# Altium project stm32-can-converter-unit.PrjPcb (part 1 of 2)
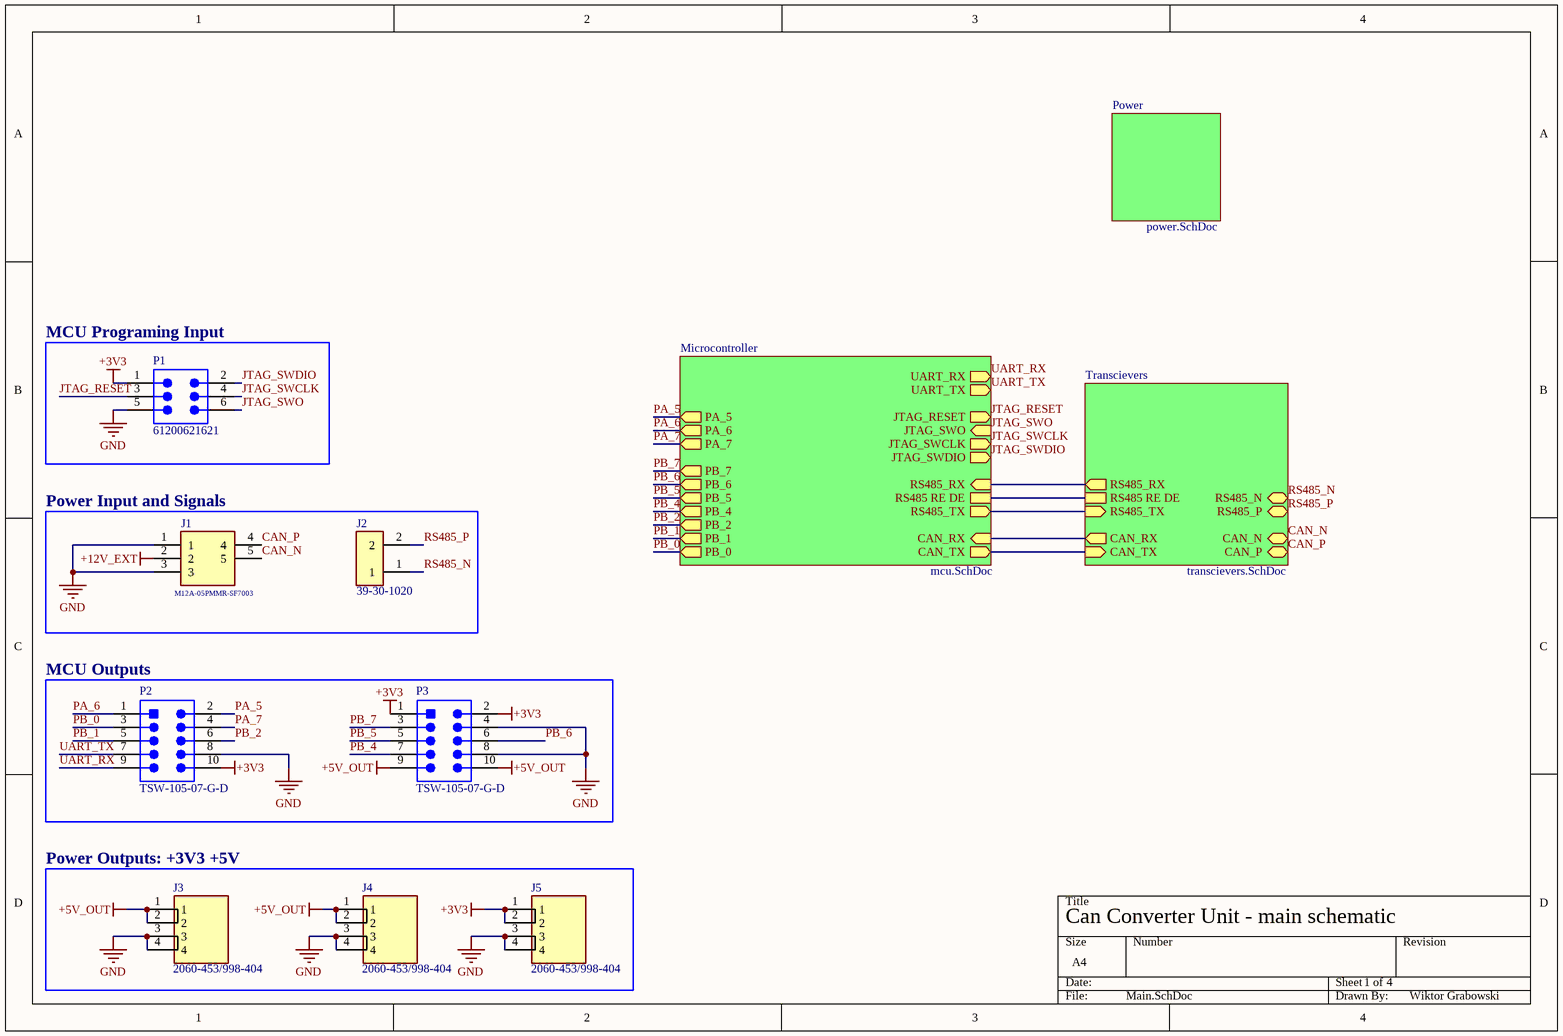
[diagram p0: Main.SchDoc]
4 sheets, 64 parts. Net scope: hierarchical (ports join the sheet entries above them; power ports are global).
Board file: CCU.PcbDoc
Sheets:
  Main.SchDoc
    Microcontroller = mcu.SchDoc
    Power = power.SchDoc
    Transcievers = transcievers.SchDoc

## Sheet Main.SchDoc
size A4; SheetNumber: 1; SheetTotal: 4

### Parts
J1  M12A-05PMMR-SF7003  [M12A05PMMRSF7003]
J2  39-30-1020  [39-30-1020]
J3  2060-453/998-404  [WAGO-2060-452-998-404]
J4  2060-453/998-404  [WAGO-2060-452-998-404]
J5  2060-453/998-404  [WAGO-2060-452-998-404]
P1  61200621621  [61200621621]
P2  TSW-105-07-G-D  [SMTC-TSW-105-07-G-D_V]
P3  TSW-105-07-G-D  [SMTC-TSW-105-07-G-D_V]

### Blocks framed on the sheet
MCU Programing Input: P1
Power Input and Signals: J1 J2
MCU Outputs: P2 P3
Power Outputs: +3V3 +5V: J3-J5

### Sub-sheets
Microcontroller = mcu.SchDoc: UART_TX (out), UART_RX (out), RS485_TX (out), RS485_RX (in), PA_5 (out), PB_1 (out), PB_2 (out), PB_7 (out), PB_6 (out), PB_5 (out), PB_4 (out), PB_0 (out), RS485 RE DE, JTAG_SWO (in), JTAG_SWCLK (out), JTAG_SWDIO (out), PA_7 (out), PA_6 (out), CAN_RX (in), CAN_TX (out), JTAG_RESET (out)
Power = power.SchDoc: no entries
Transcievers = transcievers.SchDoc: RS485_RX (out), RS485_TX (in), RS485 RE DE, CAN_P (bidir), CAN_N (bidir), RS485_N (bidir), RS485_P (bidir), CAN_RX (out), CAN_TX (in)

### Nets
+3V3: J5.1 J5.2 P1.1 P2.10 P3.1 P3.2
+5V_OUT: J3.1 J3.2 J4.1 J4.2 P3.9 P3.10
+12V_EXT: J1.2
GND: J1.1 J1.3 J3.3 J3.4 J4.3 J4.4 J5.3 J5.4 P1.5 P2.8 P3.4 P3.8
CAN RX: sheet Microcontroller/CAN_RX, sheet Transcievers/CAN_RX
CAN TX: sheet Microcontroller/CAN_TX, sheet Transcievers/CAN_TX
CAN_N: J1.5 ; sheet Transcievers/CAN_N
CAN_P: J1.4 ; sheet Transcievers/CAN_P
JTAG_RESET: P1.3 ; sheet Microcontroller/JTAG_RESET
JTAG_SWCLK: P1.4 ; sheet Microcontroller/JTAG_SWCLK
JTAG_SWDIO: P1.2 ; sheet Microcontroller/JTAG_SWDIO
JTAG_SWO: P1.6 ; sheet Microcontroller/JTAG_SWO
PA_5: P2.2 ; sheet Microcontroller/PA_5
PA_6: P2.1 ; sheet Microcontroller/PA_6
PA_7: P2.4 ; sheet Microcontroller/PA_7
PB_0: P2.3 ; sheet Microcontroller/PB_0
PB_1: P2.5 ; sheet Microcontroller/PB_1
PB_2: P2.6 ; sheet Microcontroller/PB_2
PB_4: P3.7 ; sheet Microcontroller/PB_4
PB_5: P3.5 ; sheet Microcontroller/PB_5
PB_6: P3.6 ; sheet Microcontroller/PB_6
PB_7: P3.3 ; sheet Microcontroller/PB_7
RS485 RX: sheet Microcontroller/RS485_RX, sheet Transcievers/RS485_RX
RS485 TX: sheet Microcontroller/RS485_TX, sheet Transcievers/RS485_TX
RS485_N: J2.1 ; sheet Transcievers/RS485_N
RS485_P: J2.2 ; sheet Transcievers/RS485_P
RS485_RE_DE: sheet Microcontroller/RS485 RE DE, sheet Transcievers/RS485 RE DE
UART_RX: P2.9 ; sheet Microcontroller/UART_RX
UART_TX: P2.7 ; sheet Microcontroller/UART_TX

### Notes on the sheet
- Can Converter Unit - main schematic
- 1
- 4
- Wiktor Grabowski

### Library data of the parts
J1 = M12A-05PMMR-SF7003: M12, A Code, 4A, 05 pins, Male Contact, Hexagonal, M12*1.0, PCB 90ø, Front Fastened, IP67; Manufacturer_Name: Amphenol; Manufacturer: Amphenol LTW; Geometry.Height: 15mm; Connector Type: Signal; Number of Positions: 5; Voltage Rating: 60V; Manufacturer_Part_Number: M12A-05PMMR-SF7003; Mouser Part Number: 523-M12A05PMMRSF7003; Mouser Price/Stock: https://www.mouser.co.uk/ProductDetail/Amphenol-LTW/M12A-05PMMR-SF7003?qs=f9yNj16SXrIdWSE1H9dLLQ%3D%3D; Arrow Part Number: M12A-05PMMR-SF7003; Arrow Price/Stock: https://www.arrow.com/en/products/m12a-05pmmr-sf7003/amphenol?utm_currency=USD&region=nac; Datasheet Link: https://amphenolltw.com/down.php?prod_files=605433; Supplier: Avnet; Supplier Part Number: 50AC2957; Manufacturer Part Number: M12A-05PMMR-SF7003; RoHS: Compliant; Category: Circular Connectors; Stock: 32; Current Rating: 4A; Gender: Male; Lifecycle Status: Production; Pins: 5; ComponentLink1URL: https://datasheet.octopart.com:443/M12A-05PMMR-SF7003-Amphenol-datasheet-182346588.pdf?src-supplier=IHS; ComponentLink1Description: https://datasheet.octopart.com:443/M12A-05PMMR-SF7003-Amphenol-datasheet-182346588.pdf?src-supplier=IHS; ComponentLink2URL: https://datasheet.octopart.com:443/M12A-05PMMR-SF7003-Amphenol-LTW-datasheet-184719079.pdf?src-supplier=TME; ComponentLink2Description: https://datasheet.octopart.com:443/M12A-05PMMR-SF7003-Amphenol-LTW-datasheet-184719079.pdf?src-supplier=TME; ComponentLink3URL: https://datasheet.octopart.com:443/M12A-05PMMR-SF7003-Amphenol-LTW-datasheet-180194516.pdf?src-supplier=JRH+Electronics; ComponentLink3Description: https://datasheet.octopart.com:443/M12A-05PMMR-SF7003-Amphenol-LTW-datasheet-180194516.pdf?src-supplier=JRH+Electronics
J2 = 39-30-1020: Pin Header, Power, 2 Rows, 2 Contacts, Through Hole Right Angle, Mini-Fit Jr. 5569; Manufacturer: Molex; Manufacturer Lifecycle Status: ACTIVE; Approvals: CSA, TUV, UL; Connector Type: Power, Rectangular; Contact Resistance: 10mΩ; Current Rating: 9A; Dielectric Material: Polyamide; Gender: Male; Glow Wire Compliant: Non-compliant; Insulation Resistance: 1GΩ; Number of Circuits: 2; Pitch: 4.2mm; Plating Thickness: 2.54µm; Voltage Rating: 600V; Supplier: RS; Supplier Part Number: 5109837P; Manufacturer Part Number: 39-30-1020; RoHS: Compliant; Category: Headers and Wire Housings; Stock: 13118; China RoHS: Compliant; Color: Natural; Contact Gender: Male; Contact Material: Brass; Contact Plating: Tin; Country of Origin: US; Depth: 13.38mm; ELV: Compliant; Flammability Rating: UL94 V-2; Halogen Free: Low Halogen; Height: 14.76mm; Housing Material: Nylon; Lead Free: Lead Free; Lead Pitch: 4.2mm; Length: 36.07mm; Lifecycle Status: Production; Material: Nylon; Max Operating Temperature: 105°C; Min Operating Temperature: -40°C; Mounting Technology: PCB, Through Hole; Number of Contacts: 2; Pins: 2; Number of Poles: 2; Number of Positions: 2; Number of Rows: 2; Orientation: Right Angle; Radiation Hardening: No; REACH SVHC: Yes; Row Spacing: 4.2mm; Schedule B: 8536694040, 8536694040|8536694040, 8536694040|8536694040|8536694040, 8536694040|8536694040|8536694040|8536694040; Termination: Solder; Voltage Rating (AC): 600V; Voltage Rating (DC): 600V; Working Voltage: 600V; ComponentLink1URL: https://datasheet.octopart.com:443/39-30-1020-Molex-datasheet-120074128.pdf?src-supplier=IHS; ComponentLink1Description: https://datasheet.octopart.com:443/39-30-1020-Molex-datasheet-120074128.pdf?src-supplier=IHS; ComponentLink2URL: https://datasheet.octopart.com:443/039301020-Molex-datasheet-8338717.pdf?src-supplier=Upverter; ComponentLink2Description: https://datasheet.octopart.com:443/039301020-Molex-datasheet-8338717.pdf?src-supplier=Upverter; ComponentLink3URL: https://datasheet.octopart.com:443/39-30-1020-Molex-datasheet-13785309.pdf?src-supplier=Molex; ComponentLink3Description: https://datasheet.octopart.com:443/39-30-1020-Molex-datasheet-13785309.pdf?src-supplier=Molex; ComponentLink4URL: https://sigma.octopart.com:443/15644801/technical_drawing/Molex-39-30-1020.pdf?src-supplier=Molex; ComponentLink4Description: https://sigma.octopart.com:443/15644801/technical_drawing/Molex-39-30-1020.pdf?src-supplier=Molex; ComponentLink5URL: https://datasheet.octopart.com:443/39-30-1020-Molex-datasheet-36854730.pdf?src-supplier=Farnell; ComponentLink5Description: https://datasheet.octopart.com:443/39-30-1020-Molex-datasheet-36854730.pdf?src-supplier=Farnell; ComponentLink6URL: https://datasheet.octopart.com:443/39-30-1020-Molex-datasheet-101582405.pdf?src-supplier=Farnell; ComponentLink6Description: https://datasheet.octopart.com:443/39-30-1020-Molex-datasheet-101582405.pdf?src-supplier=Farnell; ComponentLink7URL: https://datasheet.octopart.com:443/39-30-1020-..-Molex-datasheet-81470918.pdf?src-supplier=Farnell; ComponentLink7Description: https://datasheet.octopart.com:443/39-30-1020-..-Molex-datasheet-81470918.pdf?src-supplier=Farnell; ComponentLink8URL: https://datasheet.octopart.com:443/39-30-1020-Molex-datasheet-14711183.pdf?src-supplier=Farnell; ComponentLink8Description: https://datasheet.octopart.com:443/39-30-1020-Molex-datasheet-14711183.pdf?src-supplier=Farnell; ComponentLink9URL: https://datasheet.octopart.com:443/39-30-1020-Molex-datasheet-10541087.pdf?src-supplier=Farnell; ComponentLink9Description: https://datasheet.octopart.com:443/39-30-1020-Molex-datasheet-10541087.pdf?src-supplier=Farnell; ComponentLink10URL: https://datasheet.octopart.com:443/39301020-Molex-datasheet-514359.pdf?src-supplier=Farnell; ComponentLink10Description: https://datasheet.octopart.com:443/39301020-Molex-datasheet-514359.pdf?src-supplier=Farnell; ComponentLink11URL: https://datasheet.octopart.com:443/39-30-1020-Molex-datasheet-154749331.pdf?src-supplier=Master+Electronics; ComponentLink11Description: https://datasheet.octopart.com:443/39-30-1020-Molex-datasheet-154749331.pdf?src-supplier=Master+Electronics; ComponentLink12URL: https://datasheet.octopart.com:443/39-30-1020-Molex-datasheet-21827347.pdf?src-supplier=Electro+Sonic; ComponentLink12Description: https://datasheet.octopart.com:443/39-30-1020-Molex-datasheet-21827347.pdf?src-supplier=Electro+Sonic; ComponentLink13URL: https://datasheet.octopart.com:443/39-30-1020-Molex-datasheet-62104194.pdf?src-supplier=Electro+Sonic; ComponentLink13Description: https://datasheet.octopart.com:443/39-30-1020-Molex-datasheet-62104194.pdf?src-supplier=Electro+Sonic; ComponentLink14URL: https://datasheet.octopart.com:443/39-30-1020-Molex-datasheet-140183168.pdf?src-supplier=RS+(Formerly+Allied+Electronics); ComponentLink14Description: https://datasheet.octopart.com:443/39-30-1020-Molex-datasheet-140183168.pdf?src-supplier=RS+(Formerly+Allied+Electronics); ComponentLink15URL: https://datasheet.octopart.com:443/39-30-1020-Molex-datasheet-120148721.pdf?src-supplier=RS+(Formerly+Allied+Electronics); ComponentLink15Description: https://datasheet.octopart.com:443/39-30-1020-Molex-datasheet-120148721.pdf?src-supplier=RS+(Formerly+Allied+Electronics); ComponentLink16URL: https://datasheet.octopart.com:443/39-30-1020-Molex-datasheet-34442213.pdf?src-supplier=RS+(Formerly+Allied+Electronics); ComponentLink16Description: https://datasheet.octopart.com:443/39-30-1020-Molex-datasheet-34442213.pdf?src-supplier=RS+(Formerly+Allied+Electronics); ComponentLink17URL: https://datasheet.octopart.com:443/39-30-1020-Molex-datasheet-9997016.pdf?src-supplier=RS+(Formerly+Allied+Electronics); ComponentLink17Description: https://datasheet.octopart.com:443/39-30-1020-Molex-datasheet-9997016.pdf?src-supplier=RS+(Formerly+Allied+Electronics); ComponentLink18URL: https://datasheet.octopart.com:443/39-30-1020-Molex-datasheet-46140.pdf?src-supplier=RS+(Formerly+Allied+Electronics); ComponentLink18Description: https://datasheet.octopart.com:443/39-30-1020-Molex-datasheet-46140.pdf?src-supplier=RS+(Formerly+Allied+Electronics); ComponentLink19URL: https://datasheet.octopart.com:443/39301020-Molex-datasheet-82994803.pdf?src-supplier=Newark; ComponentLink19Description: https://datasheet.octopart.com:443/39301020-Molex-datasheet-82994803.pdf?src-supplier=Newark; ComponentLink20URL: https://datasheet.octopart.com:443/39-30-1020-Molex-datasheet-33002868.pdf?src-supplier=Newark; ComponentLink20Description: https://datasheet.octopart.com:443/39-30-1020-Molex-datasheet-33002868.pdf?src-supplier=Newark; ComponentLink21URL: https://datasheet.octopart.com:443/39-30-1020-Molex-datasheet-21207481.pdf?src-supplier=Newark; ComponentLink21Description: https://datasheet.octopart.com:443/39-30-1020-Molex-datasheet-21207481.pdf?src-supplier=Newark; ComponentLink22URL: https://datasheet.octopart.com:443/39-30-1020-Molex-datasheet-2405.pdf?src-supplier=Newark; ComponentLink22Description: https://datasheet.octopart.com:443/39-30-1020-Molex-datasheet-2405.pdf?src-supplier=Newark; ComponentLink23URL: https://datasheet.octopart.com:443/39301020-Molex-datasheet-137316104.pdf?src-supplier=Future+Electronics; ComponentLink23Description: https://datasheet.octopart.com:443/39301020-Molex-datasheet-137316104.pdf?src-supplier=Future+Electronics; ComponentLink24URL: https://datasheet.octopart.com:443/39-30-1020-Molex-datasheet-21395541.pdf?src-supplier=TME; ComponentLink24Description: https://datasheet.octopart.com:443/39-30-1020-Molex-datasheet-21395541.pdf?src-supplier=TME; ComponentLink25URL: https://datasheet.octopart.com:443/39301020-Molex-datasheet-7600579.pdf?src-supplier=Jameco; ComponentLink25Description: https://datasheet.octopart.com:443/39301020-Molex-datasheet-7600579.pdf?src-supplier=Jameco; ComponentLink26URL: https://datasheet.octopart.com:443/39-30-1020-Molex-datasheet-46912895.pdf?src-supplier=Jameco; ComponentLink26Description: https://datasheet.octopart.com:443/39-30-1020-Molex-datasheet-46912895.pdf?src-supplier=Jameco; ComponentLink27URL: https://datasheet.octopart.com:443/39-30-1020-Molex-datasheet-131607.pdf?src-supplier=DigiKey; ComponentLink27Description: https://datasheet.octopart.com:443/39-30-1020-Molex-datasheet-131607.pdf?src-supplier=DigiKey; ComponentLink28URL: http://sigma.octopart.com:80/15645372/rohs_certificate/Molex-39-30-1020.pdf?src-supplier=Compliance+Statements; ComponentLink28Description: http://sigma.octopart.com:80/15645372/rohs_certificate/Molex-39-30-1020.pdf?src-supplier=Compliance+Statements; ComponentLink29URL: http://sigma.octopart.com:80/conflict_mineral_statement/Molex-company-72.pdf?src-supplier=Compliance+Statements; ComponentLink29Description: http://sigma.octopart.com:80/conflict_mineral_statement/Molex-company-72.pdf?src-supplier=Compliance+Statements; ComponentLink30URL: http://sigma.octopart.com:80/rohs_statement/Molex-company-73.pdf?src-supplier=Compliance+Statements; ComponentLink30Description: http://sigma.octopart.com:80/rohs_statement/Molex-company-73.pdf?src-supplier=Compliance+Statements; ComponentLink31URL: http://sigma.octopart.com:80/reach_statement/Molex-company-74.pdf?src-supplier=Compliance+Statements; ComponentLink31Description: http://sigma.octopart.com:80/reach_statement/Molex-company-74.pdf?src-supplier=Compliance+Statements
J3-J5 = WAGO-2060-452-998-404: SMD Pcb Terminal Block, Push-button 0.75 MM² Pin Spacing 4 Mm 3-POLE White; Manufacturer: WAGO; Approvals: CSA, EN, IEC, KEMA, cUL; Current Rating: 9A; Number of Contacts: 3; Number of Levels: 1; Pitch: 4mm; Stripping Length: -7mm; Voltage Rating: 320V; Wire/Cable Gauge: 18AWG; Supplier: Arrow Electronics; Supplier Part Number: 2060-453/998-404; Manufacturer Part Number: 2060-453/998-404; RoHS: Compliant; Category: Terminal Blocks; Stock: 3276; Pricing: 1=0,602, 10=0,569, 25=0,552, 100=0,533, 500=0,528, 1000=0,523 (USD); China RoHS: Compliant; Color: White; Contact Material: Tin; Contact Plating: Tin; Flammability Rating: UL94 V-0; Height: 4.5mm; Lead Free: Lead Free; Length: 11.9mm; Lifecycle Status: Production; Material: Copper, Tin; Number of Rows: 1; Orientation: Horizontal; REACH SVHC: Yes; Schedule B: 8536695050; Width: 10.1mm; ComponentLink1URL: https://datasheet.octopart.com:443/2060-453-998-404-WAGO-datasheet-38222450.pdf?src-supplier=SOS+electronic; ComponentLink1Description: https://datasheet.octopart.com:443/2060-453-998-404-WAGO-datasheet-38222450.pdf?src-supplier=SOS+electronic; ComponentLink2URL: https://datasheet.octopart.com:443/2060-453-998-404-WAGO-datasheet-49279272.pdf?src-supplier=Newark; ComponentLink2Description: https://datasheet.octopart.com:443/2060-453-998-404-WAGO-datasheet-49279272.pdf?src-supplier=Newark; ComponentLink3URL: https://datasheet.octopart.com:443/2060-453-998-404-WAGO-datasheet-182466479.pdf?src-supplier=Future+Electronics; ComponentLink3Description: https://datasheet.octopart.com:443/2060-453-998-404-WAGO-datasheet-182466479.pdf?src-supplier=Future+Electronics; ComponentLink4URL: https://datasheet.octopart.com:443/2060-453-998-404-WAGO-datasheet-26529559.pdf?src-supplier=Future+Electronics; ComponentLink4Description: https://datasheet.octopart.com:443/2060-453-998-404-WAGO-datasheet-26529559.pdf?src-supplier=Future+Electronics; ComponentLink5URL: https://datasheet.octopart.com:443/2060-453-998-404-WAGO-datasheet-140898747.pdf?src-supplier=Future+Electronics; ComponentLink5Description: https://datasheet.octopart.com:443/2060-453-998-404-WAGO-datasheet-140898747.pdf?src-supplier=Future+Electronics; ComponentLink6URL: https://datasheet.octopart.com:443/2060-453-998-404-WAGO-datasheet-164886439.pdf?src-supplier=Burklin+Elektronik; ComponentLink6Description: https://datasheet.octopart.com:443/2060-453-998-404-WAGO-datasheet-164886439.pdf?src-supplier=Burklin+Elektronik
P1 = CMP-1502-00000-2: NexarPartId: 32855456; Number of Positions: 6; Gender: Male; Pitch: 2.54mm; Connector Type: Male Pin; Insulation Resistance: 1GΩ; Contact Resistance: 20mΩ; Operating Supply Voltage: 250V; Current Rating: 3A; Termination: Solder; RoHS: Compliant; Length: 15.28mm; Contact Material: Copper; Number of Pins: 6; Min Operating Temperature: -40°C; Number of Contacts: 6; Number of Rows: 2; Contact Plating: Gold; Color: Black; Mount: Through Hole; Lead Pitch: 2.54mm; Insulation Material: PBT; REACH SVHC: Unknown; Row Spacing: 2.54mm; Orientation: Vertical; Max Operating Temperature: 105°C
P2 P3 = CMP-2000-07330-1: Post Terminal Strip Assembly, Pitch 2.54 mm, 2 x 5 Position, Height 8.58 mm, Tail Length 2.54 mm, -55 to 125 degC, RoHS, Bulk; Manufacturer: Samtec-Inc.; Connector Type: Header,Unshrouded; Number of Positions Loaded: All; Pitch: 0.100"(2.54mm); Number of Positions: 10; Package Reference: TSW-105-07-G-D; Mounting Technology: ThroughHole; Datasheet URL: http://suddendocs.samtec.com/prints/tsw-xxx-xx-xxx-x-xx-xxx-mkt.pdf; Termination: Solder; Packaging: Bulk; Number of Rows: 2; Contact Finish: Gold; Mounting Type: ThroughHole; Features: -; Color: Black; Category: Connectors,Interconnects; Family: RectangularConnectors-Headers,MalePins; Manufacturer URL: http://www.samtec.com/; Series: TSW; Fastening Type: -; Package URL: http://suddendocs.samtec.com/prints/tsw-xxx-xx-x-x-xx-xxx-footprint.pdf; Row Spacing: 0.100"(2.54mm); Contact Mating Length: 0.230"(5.84mm); Contact Finish Thickness: 10µin(0.25µm); Contact Type: MalePin; Package Description: Male Header, Pitch 2.54 mm, 2 x 5 Position, Height 8.58 mm, Tail Length 2.54 mm; Datasheet Version: Rev. DO, 08/1988

## Sheet mcu.SchDoc
size A4; SheetNumber: 3; SheetTotal: 4
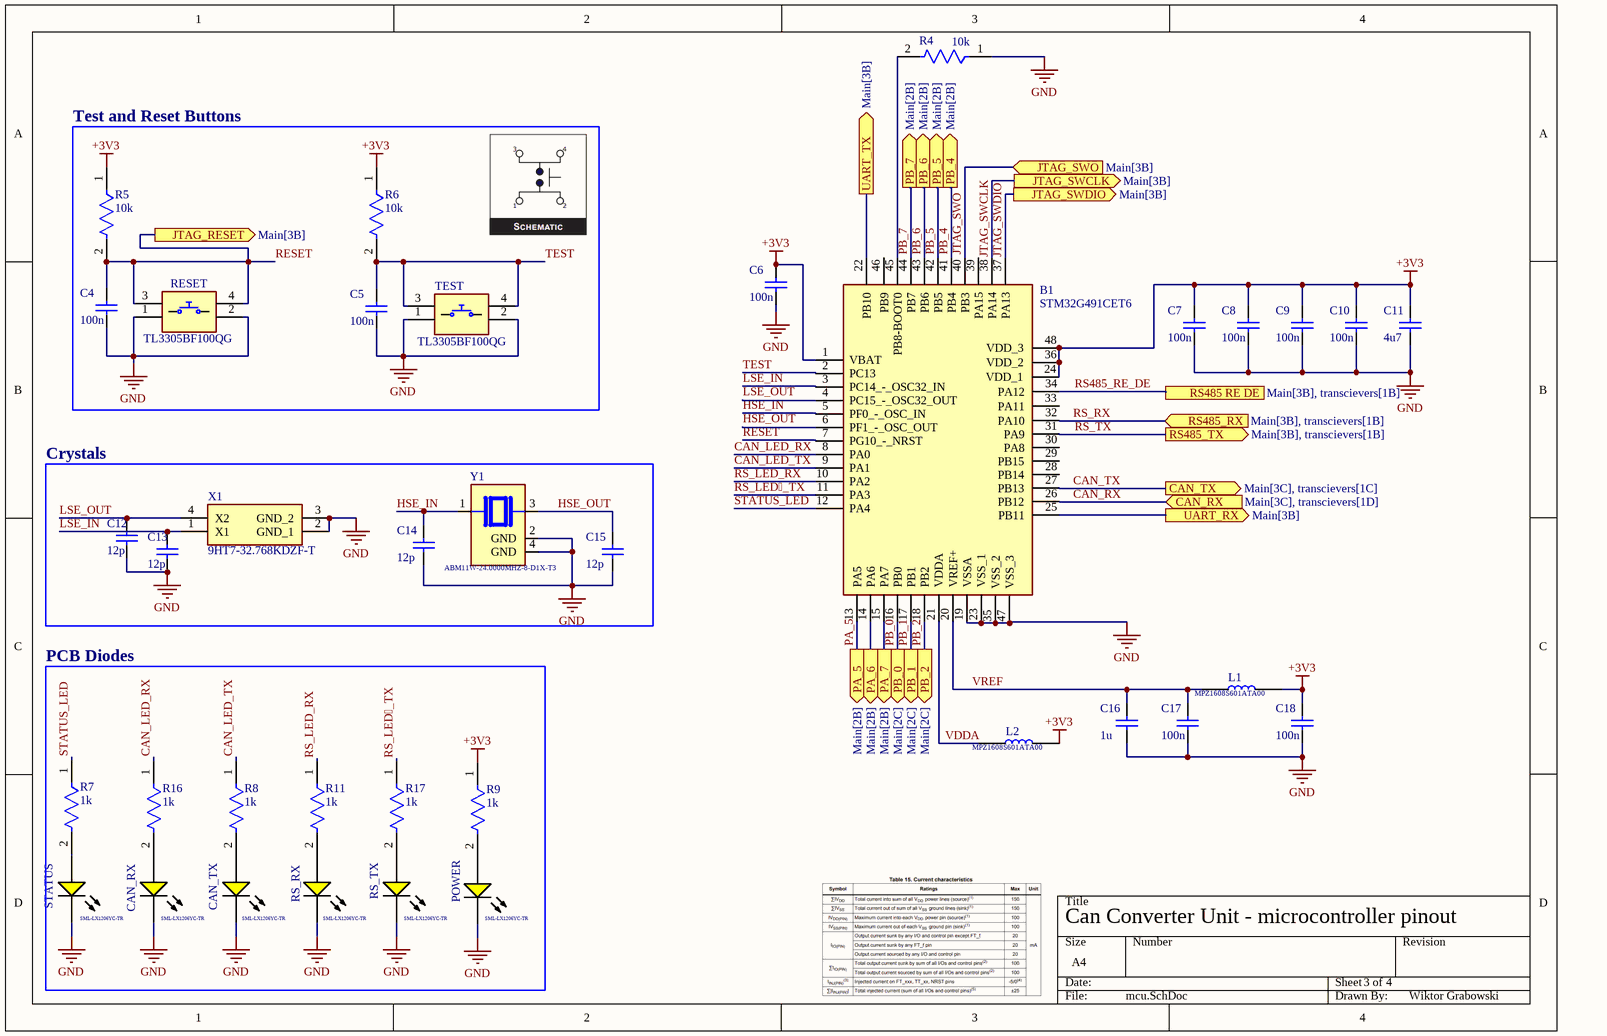
[diagram p1: mcu.SchDoc]

### Parts
B1  STM32G491CET6  [STM32G491CET6]
C4  100n  [CAPC1206(3216)170_M]
C5  100n  [CAPC1206(3216)170_M]
C6  100n  [CAPC1206(3216)170_M]
C7  100n  [CAPC1206(3216)170_M]
C8  100n  [CAPC1206(3216)170_M]
C9  100n  [CAPC1206(3216)170_M]
C10  100n  [CAPC1206(3216)170_M]
C11  4u7  [CAPC1206(3216)170_M]
C12  12p  [CAPC1206(3216)170_M]
C13  12p  [CAPC1206(3216)170_M]
C14  12p  [CAPC1206(3216)170_M]
C15  12p  [CAPC1206(3216)170_M]
C16  1u  [CAPC1206(3216)170_M]
C17  100n  [CAPC1206(3216)170_M]
C18  100n  [CAPC1206(3216)170_M]
CAN_RX  SML-LX1206YC-TR  [LUMX-SML-LX1206YC-TR_V]
CAN_TX  SML-LX1206YC-TR  [LUMX-SML-LX1206YC-TR_V]
L1  MPZ1608S601ATA00  [INDC1608X95N]
L2  MPZ1608S601ATA00  [INDC1608X95N]
POWER  SML-LX1206YC-TR  [LUMX-SML-LX1206YC-TR_V]
R4  10k  [FP-RK73H2B-MFG]
R5  10k  [FP-RK73H2B-MFG]
R6  10k  [FP-RK73H2B-MFG]
R7  1k  [FP-RK73H2B-MFG]
R8  1k  [FP-RK73H2B-MFG]
R9  1k  [FP-RK73H2B-MFG]
R11  1k  [FP-RK73H2B-MFG]
R16  1k  [FP-RK73H2B-MFG]
R17  1k  [FP-RK73H2B-MFG]
RESET  TL3305BF100QG  [TL3305BF160QG]
RS_RX  SML-LX1206YC-TR  [LUMX-SML-LX1206YC-TR_V]
RS_TX  SML-LX1206YC-TR  [LUMX-SML-LX1206YC-TR_V]
STATUS  SML-LX1206YC-TR  [LUMX-SML-LX1206YC-TR_V]
TEST  TL3305BF100QG  [TL3305BF160QG]
X1  9HT7-32.768KDZF-T  [9HT732768KDZFT]
Y1  ABM11W-24.0000MHZ-8-D1X-T3  [XTAL_ABM11W-24.0000MHZ-8-D1X-T3]

### Blocks framed on the sheet
Test and Reset Buttons: C4 C5 R5 R6 RESET TEST
Crystals: C12-C15 X1 Y1
PCB Diodes: CAN_RX CAN_TX POWER R7-R9 R11 R16 R17 RS_RX RS_TX STATUS

### Ports
CAN_RX (in, see Main[3C], transcievers[1D]), CAN_TX (out, see Main[3C], transcievers[1C]), JTAG_RESET (out, see Main[3B]), JTAG_SWCLK (out, see Main[3B]), JTAG_SWDIO (out, see Main[3B]), JTAG_SWO (in, see Main[3B]), PA_5 (out, see Main[2B]), PA_6 (out, see Main[2B]), PA_7 (out, see Main[2B]), PB_0 (out, see Main[2C]), PB_1 (out, see Main[2C]), PB_2 (out, see Main[2C]), PB_4 (out, see Main[2B]), PB_5 (out, see Main[2B]), PB_6 (out, see Main[2B]), PB_7 (out, see Main[2B]), RS485 RE DE (see Main[3B], transcievers[1B]), RS485_RX (in, see Main[3B], transcievers[1B]), RS485_TX (out, see Main[3B], transcievers[1B]), UART_RX (out, see Main[3B]), UART_TX (out, see Main[3B])

### Nets
+3V3: B1.1(VBAT) B1.24(VDD_1) B1.36(VDD_2) B1.48(VDD_3) C6.2 C7.2 C8.2 C9.2 C10.2 C11.2 C18.2 L1.2 L2.2 R5.1 R6.1 R9.1
GND: B1.19(VSSA) B1.23(VSS_1) B1.35(VSS_2) B1.47(VSS_3) C4.1 C5.1 C6.1 C7.1 C8.1 C9.1 C10.1 C11.1 C12.1 C13.1 C14.1 C15.1 C16.1 C17.1 C18.1 CAN_RX.2(K) CAN_TX.2(K) POWER.2(K) R4.1 RESET.1 RESET.2 RS_RX.2(K) RS_TX.2(K) STATUS.2(K) TEST.1 TEST.2 X1.2(GND_1) X1.3(GND_2) Y1.2(GND) Y1.4(GND)
CAN_LED_RX: B1.8(PA0) R16.1
CAN_LED_TX: B1.9(PA1) R8.1
CAN_RX: B1.26(PB12) ; port CAN_RX  [project net CAN RX]
CAN_TX: B1.27(PB13) ; port CAN_TX  [project net CAN TX]
HSE_IN: B1.5(PF0_-_OSC_IN) C14.2 Y1.1
HSE_OUT: B1.6(PF1_-_OSC_OUT) C15.2 Y1.3
JTAG_SWCLK: B1.38(PA14) ; port JTAG_SWCLK
JTAG_SWDIO: B1.37(PA13) ; port JTAG_SWDIO
JTAG_SWO: B1.40(PB3) ; port JTAG_SWO
LSE_IN: B1.3(PC14_-_OSC32_IN) C13.2 X1.1(X1)
LSE_OUT: B1.4(PC15_-_OSC32_OUT) C12.2 X1.4(X2)
PA_5: B1.13(PA5) ; port PA_5
PA_6: B1.14(PA6) ; port PA_6
PA_7: B1.15(PA7) ; port PA_7
PB_0: B1.16(PB0) ; port PB_0
PB_1: B1.17(PB1) ; port PB_1
PB_2: B1.18(PB2) ; port PB_2
PB_4: B1.41(PB4) ; port PB_4
PB_5: B1.42(PB5) ; port PB_5
PB_6: B1.43(PB6) ; port PB_6
PB_7: B1.44(PB7) ; port PB_7
RESET: B1.7(PG10_-_NRST) C4.2 R5.2 RESET.3 RESET.4 ; port JTAG_RESET  [project net JTAG_RESET]
RS485_RE_DE: B1.34(PA12) ; port RS485 RE DE
RS_LED_TX: B1.11(PA3) R17.1
RS_LED_RX: B1.10(PA2) R11.1
RS_RX: B1.32(PA10) ; port RS485_RX  [project net RS485 RX]
RS_TX: B1.31(PA9) ; port RS485_TX  [project net RS485 TX]
STATUS_LED: B1.12(PA4) R7.1
TEST: B1.2(PC13) C5.2 R6.2 TEST.3 TEST.4
UART_RX: B1.25(PB11) ; port UART_RX
UART_TX: B1.22(PB10) ; port UART_TX
VDDA: B1.21(VDDA) L2.1
VREF: B1.20(VREF+) C16.2 C17.2 L1.1
NetB1_45: B1.45(PB8-BOOT0) R4.2
NetCAN_RX_1: CAN_RX.1(A) R16.2
NetCAN_TX_1: CAN_TX.1(A) R8.2
NetPOWER_1: POWER.1(A) R9.2
NetR7_2: R7.2 STATUS.1(A)
NetR11_2: R11.2 RS_RX.1(A)
NetR17_2: R17.2 RS_TX.1(A)

Not connected (* = marked no-connect by the designer): B1 28(PB14) 29(PB15) 30(PA8) 33(PA11) 39(PA15) 46(PB9)

### Notes on the sheet
- Can Converter Unit - microcontroller pinout
- 3
- 4
- Wiktor Grabowski

### Library data of the parts
B1 = STM32G491CET6: ARM Microcontrollers - MCU Mainstream Arm Cortex-M4+ MCU 170MHz with 512Kbytes of Flash memory; Manufacturer_Name: STMicroelectronics; Geometry.Height: 1.6mm; Manufacturer_Part_Number: STM32G491CET6; Mouser Part Number: 511-STM32G491CET6; Mouser Price/Stock: https://www.mouser.co.uk/ProductDetail/STMicroelectronics/STM32G491CET6?qs=eP2BKZSCXI5LxAF%2FNuF5Tg%3D%3D; Arrow Part Number: STM32G491CET6; Arrow Price/Stock: https://www.arrow.com/en/products/stm32g491cet6/stmicroelectronics?region=nac; Datasheet Link: https://cz.mouser.com/datasheet/2/389/dm00654712-2042072.pdf; Supplier: Mouser; Supplier Part Number: 511-STM32G491CET6; Supplier 1: Mouser; Supplier Part Number 1: 511-STM32G491CET6; ComponentLink1Description: Datasheet; ComponentLink1URL: https://datasheet.octopart.com/STM32G491CET6-STMicroelectronics-datasheet-151949616.pdf?src-supplier=Future+Electronics
C4-C18 = CMP-1037-04008-1: CAP 47nF 200V ±10% 1206 (3216 Metric) Thickness 1.7mm SMD; Tolerance: Â±10%; Case-EIA: 1206; Case-Metric: 3216; Technology: SMT; Max Thickness: 1.7 mm; Value: 47nF; Rated Voltage: 200 V
CAN_RX CAN_TX POWER RS_RX RS_TX STATUS = CMP-2000-07124-1: Yellow LED, Water Clear Len, 585 nm, 2.1 V, -40 to 85 degC, 2-Pin SMD, RoHS, Tape and Reel; Manufacturer: Lumex; Product Training Modules: LEDsBenefitsofCustomLEDandLCDTechnology; Millicandela Rating: 6mcd; Catalog Drawings: SML-LX1206SeriesTopSML-LX1206SeriesSideSML-LX1206SeriesBottomSML-LX1206SeriesFootprint; Wavelength - Peak: 585nm; Other Names: 67-1358-2LU60357TRSMLLX1206YCTR; Lens Style/Size: RectanglewithFlatTop; Current - Test: 20mA; Lens Color: Colorless; Viewing Angle: 160°; Voltage - Forward (Vf) (Typ): 2.1V; Online Catalog: SML-LX1206RectanglewithFlatTop1206PackageLEDs; Mounting Type: SurfaceMount; Package Description: 2-Pin Surface Mount Device, Body 3.2 x 1.5 mm; Datasheet Version: Rev. K, 08/2012; Features: -; Color: Yellow; RoHS Information: RoHSCertofCompliance; Package Reference: SML-LX1206YC-TR; Supplier Device Package: 1206; Standard Package: 3,000; Series: -; Wavelength - Dominant: -; Package / Case: 1206(3216Metric); Mounting Technology: SurfaceMount; Height (Max): 1.10mm; Lens Transparency: Clear; Datasheet URL: http://www.lumex.com/content/files/ProductAttachment/SML-LX1206YC-TR.pdf; Family: LEDIndication-Discrete; Manufacturer URL: http://www.lumexinstruments.com/; Packaging: Tape&Reel(TR); Category: Optoelectronics; Size / Dimension: 3.20mmLx1.60mmW
L1 L2 = MPZ1608S601ATA00: Ferrite Beads Multi-Layer 600Ohm 25% 100MHz 1A 0.15Ohm DCR 0603 T/R; Manufacturer Lifecycle Status: PRODUCTION; MF: TDK; DC Resistance (DCR): 150mΩ; Impedance: 600Ω; Number of Circuits: 1; SnapEDA_Link: https://www.snapeda.com/parts/MPZ1608S601ATA00/TDK/view-part/?ref=snap; Package: 0603 TDK; Value: *; MP: MPZ1608S601ATA00; Check_prices: https://www.snapeda.com/parts/MPZ1608S601ATA00/TDK/view-part/?ref=eda; Supplier: Farnell; Supplier Part Number: 2800777; Manufacturer: TDK; Manufacturer Part Number: MPZ1608S601ATA00; RoHS: Compliant; Category: Ferrite Beads and Chips; Stock: 80000; Case/Package: 0603; Case Code (Imperial): 0603; Case Code (Metric): 1608; China RoHS: Compliant; Core Material: Ferrite; Current Rating: 1A; Depth: 800µm; Height: 800µm; Lead Free: Lead Free; Length: 1.6mm; Lifecycle Status: Production; Max DC Current: 1A; Clock Frequency: 100MHz; Max Length: 1.75mm; Max Operating Temperature: 125°C; Max Width: 950µm; Min Length: 1.45mm; Min Operating Temperature: -55°C; Min Width: 650µm; Mounting Technology: Surface Mount; Number of Terminals: 2; Packaging: Cut Tape; REACH SVHC: Yes; RMS Current (Irms): 1A; Schedule B: 8504500000, 8504500000|8504500000|8504500000|8504500000|8504500000; ESR: 150mΩ; Termination: SMD/SMT; Test Frequency: 100MHz; Tolerance: 25%; Weight: 2.012816mg; Width: 800µm; ComponentLink1URL: https://datasheet.octopart.com:443/MPZ1608S601ATA00-TDK-datasheet-155380319.pdf?src-supplier=TDK; ComponentLink1Description: https://datasheet.octopart.com:443/MPZ1608S601ATA00-TDK-datasheet-155380319.pdf?src-supplier=TDK; ComponentLink2URL: https://datasheet.octopart.com:443/MPZ1608S601ATA00-TDK-datasheet-141913842.pdf?src-supplier=TME; ComponentLink2Description: https://datasheet.octopart.com:443/MPZ1608S601ATA00-TDK-datasheet-141913842.pdf?src-supplier=TME; ComponentLink3URL: https://datasheet.octopart.com:443/MPZ1608S601ATA00-TDK-datasheet-82475260.pdf?src-supplier=Newark; ComponentLink3Description: https://datasheet.octopart.com:443/MPZ1608S601ATA00-TDK-datasheet-82475260.pdf?src-supplier=Newark; ComponentLink4URL: https://datasheet.octopart.com:443/MPZ1608S601ATA00-TDK-datasheet-99917310.pdf?src-supplier=Newark; ComponentLink4Description: https://datasheet.octopart.com:443/MPZ1608S601ATA00-TDK-datasheet-99917310.pdf?src-supplier=Newark; ComponentLink5URL: https://datasheet.octopart.com:443/MPZ1608S601ATA00-TDK-datasheet-8852356.pdf?src-supplier=Newark; ComponentLink5Description: https://datasheet.octopart.com:443/MPZ1608S601ATA00-TDK-datasheet-8852356.pdf?src-supplier=Newark; ComponentLink6URL: https://datasheet.octopart.com:443/MPZ1608S601ATA00-TDK-datasheet-21631858.pdf?src-supplier=Farnell; ComponentLink6Description: https://datasheet.octopart.com:443/MPZ1608S601ATA00-TDK-datasheet-21631858.pdf?src-supplier=Farnell; ComponentLink7URL: https://datasheet.octopart.com:443/MPZ1608S601ATA00-TDK-datasheet-38423207.pdf?src-supplier=Future+Electronics; ComponentLink7Description: https://datasheet.octopart.com:443/MPZ1608S601ATA00-TDK-datasheet-38423207.pdf?src-supplier=Future+Electronics
R4-R9 R11 R16 R17 = CMP-04015-098385-1: 40.2kΩ ±1% 0.25W Chip Resistor 1206 Thick Film AEC-Q200 Qualified; Resistance: 40.2kR; Voltage Rating (DC): 200V; Temperature Coefficient: 100ppm/°C; Power Rating: 250mW; Tolerance: 1%; Package Quantity: 5000; Length: 3.2mm; Termination: SMD/SMT; Lead Free: Contains Lead; Case Code (Imperial): 1206; Case/Package: 1206; Voltage Rating: 200V; Case Code (Metric): 3216; Max Operating Temperature: 155°C; Packaging: Tape and Reel; Width: 1.6mm; Series: RK73H; Min Operating Temperature: -55°C; RoHS Compliant: No; Height: 0.6mm
RESET TEST = TL3305BF100QG: TL3305 Ultra-Miniature Tact Switch 100gf 5.0mm actuator Silver Contact Gullwing; Manufacturer_Name: E-Switch; Datasheet Link: https://configured-product-images.s3.amazonaws.com/2D/specs/TL3305BF100QG.pdf; Manufacturer_Part_Number: TL3305BF100QG; Mouser Part Number: 612-TL3305BF100QG; Mouser Price/Stock: https://www.mouser.co.uk/ProductDetail/E-Switch/TL3305BF100QG?qs=IKkN%2F947nfDIPwqPQja%252BvQ%3D%3D; Supplier: Farnell; Supplier Part Number: 4539028; Manufacturer: E-Switch; Manufacturer Part Number: TL3305BF100QG; RoHS: Compliant; Category: Tactile Switches; Stock: 11760; ComponentLink1URL: https://datasheet.octopart.com:443/TL3305BF100QG-E-Switch-datasheet-181388209.pdf?src-supplier=Future+Electronics; ComponentLink1Description: https://datasheet.octopart.com:443/TL3305BF100QG-E-Switch-datasheet-181388209.pdf?src-supplier=Future+Electronics; ComponentLink2URL: https://datasheet.octopart.com:443/TL3305BF100QG-E-Switch-datasheet-188129426.pdf?src-supplier=Future+Electronics; ComponentLink2Description: https://datasheet.octopart.com:443/TL3305BF100QG-E-Switch-datasheet-188129426.pdf?src-supplier=Future+Electronics
X1 = 9HT7-32.768KDZF-T: Parallel - Fundamental Quartz Crystal, 0.032768MHz Nom; Manufacturer_Name: TXC CORPORATION; Manufacturer: TXC; Geometry.Height: 1.4mm; ESR (Equivalent Series Resistance): 65kΩ; Frequency: 32.768kHz; Frequency Tolerance: 0.002%; Load Capacitance: 12.5pF; Manufacturer_Part_Number: 9HT7-32.768KDZF-T; Mouser Part Number: 717-9HT7-32.768KDZFT; Mouser Price/Stock: https://www.mouser.co.uk/ProductDetail/TXC-Corporation/9HT7-32.768KDZF-T?qs=MEJ8UTjcHDlobjP3Uu4Bsg%3D%3D; Arrow Part Number: 9HT7-32.768KDZF-T; Arrow Price/Stock: https://www.arrow.com/en/products/9ht7-32.768kdzf-t/txc-corporation?region=nac; Datasheet Link: https://componentsearchengine.com/Datasheets/2/9HT7-32.768KDZF-T.pdf; Supplier: Farnell; Supplier Part Number: 2819319; Manufacturer Part Number: 9HT7-32.768KDZF-T; RoHS: Compliant; Category: Crystals; Stock: 7957; Case/Package: SMD/SMT; Height: 508µm; Lead Free: Lead Free; Length: 1.4mm; Lifecycle Status: Production; Max Operating Temperature: 85°C; Min Operating Temperature: -40°C; Mounting Technology: Surface Mount; Packaging: Tape & Reel; REACH SVHC: No; Schedule B: 8541600080, 8541600080|8541600080|8541600080|8541600080|8541600080|8541600080|8541600080|8541600080|8541600080|8541600080|8541600080|8541600080|8541600080|8541600080|8541600080|8541600080|8541600080|8541600080|8541600080|8541600080|8541600080|8541600080|8541600080|85; Termination: SMD/SMT; Tolerance: 0.002%; Width: 1.397mm; ComponentLink1URL: https://datasheet.octopart.com:443/9HT7-32.768KDZF-T-TXC-datasheet-21225340.pdf?src-supplier=element14+APAC; ComponentLink1Description: https://datasheet.octopart.com:443/9HT7-32.768KDZF-T-TXC-datasheet-21225340.pdf?src-supplier=element14+APAC; ComponentLink2URL: https://datasheet.octopart.com:443/9HT7-32.768KDZF-T-TXC-datasheet-181441158.pdf?src-supplier=Newark; ComponentLink2Description: https://datasheet.octopart.com:443/9HT7-32.768KDZF-T-TXC-datasheet-181441158.pdf?src-supplier=Newark; ComponentLink3URL: https://datasheet.octopart.com:443/9HT7-32.768KDZF-T-TXC-datasheet-188932442.pdf?src-supplier=TME; ComponentLink3Description: https://datasheet.octopart.com:443/9HT7-32.768KDZF-T-TXC-datasheet-188932442.pdf?src-supplier=TME
Y1 = ABM11W-24.0000MHZ-8-D1X-T3: Crystal, Quartz, 24 MHz, SMD, 2mm x 1.6mm x 0.5mm, 20 ppm, 8 pF, 10 ppm, ABM11W; Manufacturer: Abracon; MF: Abracon LLC; ESR (Equivalent Series Resistance): 100Ω; Frequency: 24MHz; Frequency Stability: 20ppm; Frequency Tolerance: 0.001%; Load Capacitance: 8pF; ESR: 30Ω; SnapEDA_Link: https://www.snapeda.com/parts/ABM11W-24.0000MHZ-8-D1X-T3/Abracon/view-part/?ref=snap; Package: SMD-4 Abracon LLC; Value: *; MP: ABM11W-24.0000MHZ-8-D1X-T3; Check_prices: https://www.snapeda.com/parts/ABM11W-24.0000MHZ-8-D1X-T3/Abracon/view-part/?ref=eda; Supplier: DigiKey; Supplier Part Number: 535-13835-1-ND; Manufacturer Part Number: ABM11W-24.0000MHZ-8-D1X-T3; RoHS: Compliant; Category: Crystals; Stock: 2752; Pricing: 1=0,38, 10=0,334, 25=0,3156, 50=0,3024, 100=0,29, 250=0,27424, 500=0,26288, 1000=0,25201 (USD); China RoHS: Compliant; Height: 500µm; Length: 2mm; Lifecycle Status: Production; Max Operating Temperature: 85°C; Min Operating Temperature: -40°C; Mounting Technology: Surface Mount; REACH SVHC: Yes; Tolerance: 0.001%; Width: 1.6mm; ComponentLink1URL: https://datasheet.octopart.com:443/ABM11W-24.0000MHZ-8-D1X-T3-Abracon-datasheet-154833168.pdf?src-supplier=IHS; ComponentLink1Description: https://datasheet.octopart.com:443/ABM11W-24.0000MHZ-8-D1X-T3-Abracon-datasheet-154833168.pdf?src-supplier=IHS; ComponentLink2URL: https://datasheet.octopart.com:443/ABM11W-24.0000MHZ-8-D1X-T3-Abracon-datasheet-102760955.pdf?src-supplier=Upverter; ComponentLink2Description: https://datasheet.octopart.com:443/ABM11W-24.0000MHZ-8-D1X-T3-Abracon-datasheet-102760955.pdf?src-supplier=Upverter; ComponentLink3URL: https://datasheet.octopart.com:443/ABM11W-24.0000MHZ-8-D1X-T3-Abracon-datasheet-112015802.pdf?src-supplier=Master+Electronics; ComponentLink3Description: https://datasheet.octopart.com:443/ABM11W-24.0000MHZ-8-D1X-T3-Abracon-datasheet-112015802.pdf?src-supplier=Master+Electronics; ComponentLink4URL: https://datasheet.octopart.com:443/ABM11W-24.0000MHZ-8-D1X-T3-Abracon-datasheet-182204996.pdf?src-supplier=Master+Electronics; ComponentLink4Description: https://datasheet.octopart.com:443/ABM11W-24.0000MHZ-8-D1X-T3-Abracon-datasheet-182204996.pdf?src-supplier=Master+Electronics; ComponentLink5URL: https://sigma.octopart.com:443/141159858/technical_drawing/Abracon-ABM11W-24.0000MHZ-8-D1X-T3.pdf?src-supplier=Abracon+SCT; ComponentLink5Description: https://sigma.octopart.com:443/141159858/technical_drawing/Abracon-ABM11W-24.0000MHZ-8-D1X-T3.pdf?src-supplier=Abracon+SCT; ComponentLink6URL: http://sigma.octopart.com:80/conflict_mineral_statement/Abracon-company-27.pdf?src-supplier=Compliance+Statements; ComponentLink6Description: http://sigma.octopart.com:80/conflict_mineral_statement/Abracon-company-27.pdf?src-supplier=Compliance+Statements

## Sheet power.SchDoc
size A4; SheetNumber: 4; SheetTotal: 4
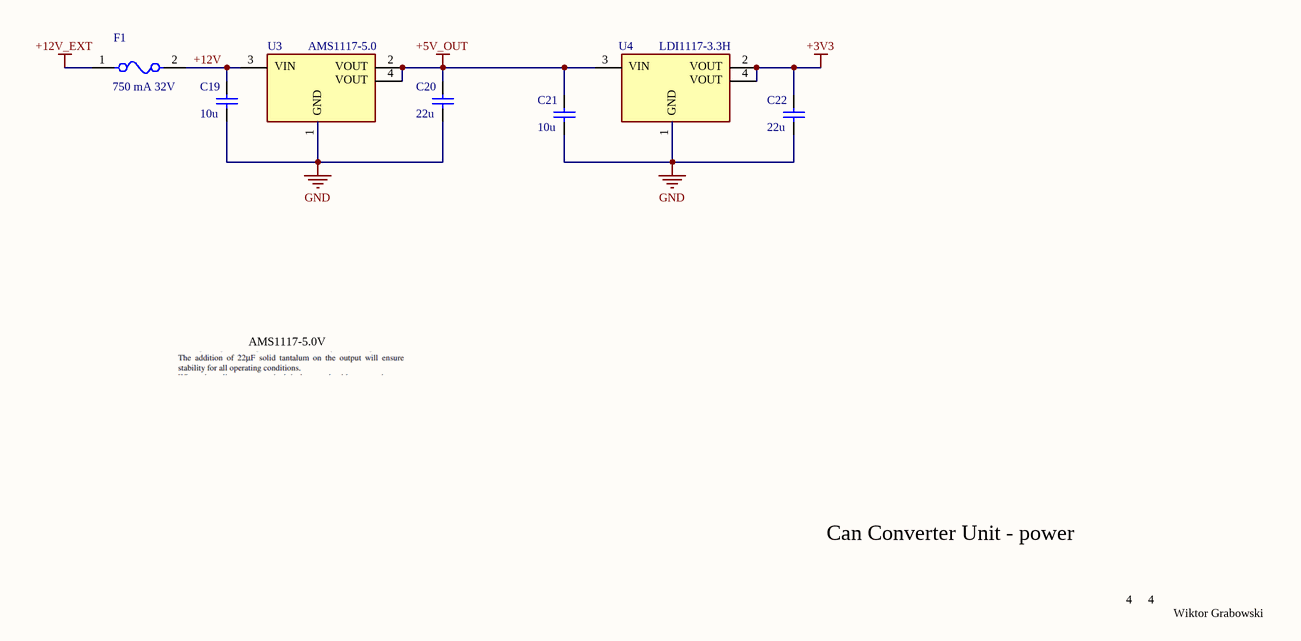
[diagram p2: power.SchDoc]

### Parts
C19  10u  [CAPC1206(3216)170_M]
C20  22u  [CAPC1206(3216)170_M]
C21  10u  [CAPC1206(3216)170_M]
C22  22u  [CAPC1206(3216)170_M]
F1  750 mA 32V  [FP-0466-MFG]
U3  AMS1117-5.0  [AMS1117-5.0]
U4  LDI1117-3.3H  [LDI1117-3.3H]

### Nets
+3V3: C22.2 U4.2 U4.4
+5V_OUT: C20.2 C21.2 U3.2 U3.4 U4.3
+12V_EXT: F1.1
GND: C19.1 C20.1 C21.1 C22.1 U3.1 U4.1
+12V: C19.2 F1.2 U3.3

### Notes on the sheet
- AMS1117-5.0V
- Can Converter Unit - power
- 4
- Wiktor Grabowski
- (in symbol AMS1117-5.0) VIN; VOUT; GND
- (in symbol LDI1117-3.3H) VIN; VOUT; GND

### Library data of the parts
C19-C22 = CMP-1037-04008-1: as C4 on sheet mcu; Technology: SMT; Max Thickness: 1.7 mm; Value: 47nF; Rated Voltage: 200 V
F1 = CMP-08605-000088-1: FUSE BOARD MOUNT 750MA 63VAC/VDC; Voltage Rating (AC): 63V; Approvals: UL; Fuse Type: Board Mount (Cartridge Style Excluded); DC Cold Resistance: 111mR; Power Dissipation: 74mW; Case Code (Imperial): 1206; Case Code (Metric): 3216; Length: 3.18mm; Height: 0.023inch; Housing Material: Ceramic; Series: SlimLine™ 466; Voltage Rating (DC): 63V; Current Rating: 750mA; Min Operating Temperature: -50°C; Width: 0.06inch; Packaging: Tape and Reel; Depth: 1.52mm; Case/Package: 1206; Mount: Surface Mount; Max Operating Temperature: 90°C; Package Quantity: 5000; RoHS Compliant: Yes; Lead Free: Lead Free
U3 = AMS1117-5.0: 1A LOW DROPOUT VOLTAGE REGULATOR; Manufacturer_Name: Advanced Monolithic Systems; Geometry.Height: 1.8mm; Manufacturer_Part_Number: AMS1117-5.0; Mouser Part Number: *; Mouser Price/Stock: *; Arrow Part Number: *; Arrow Price/Stock: *; Datasheet Link: http://www.advanced-monolithic.com/pdf/ds1117.pdf
U4 = LDI1117-3.3H: Fixed Positive LDO Regulator; Manufacturer: Diotec; Supplier: Mouser; Supplier Part Number: 637-LDI1117-3.3H; Manufacturer Part Number: LDI1117-3.3H; RoHS: No; Category: Voltage Regulators - Linear; Stock: 5056; Pricing: 1=0,4, 10=0,286, 50=0,286, 100=0,199, 1000=0,163, 10000=0,089 (USD); ComponentLink1URL: https://datasheet.octopart.com/LDI1117-3.3H-Diotec-datasheet-154607892.pdf?src-supplier=TME; ComponentLink1Description: https://datasheet.octopart.com/LDI1117-3.3H-Diotec-datasheet-154607892.pdf?src-supplier=TME; ComponentLink2URL: https://datasheet.octopart.com/LDI1117-3.3H-Diotec-datasheet-159101088.pdf?src-supplier=SOS+electronic; ComponentLink2Description: https://datasheet.octopart.com/LDI1117-3.3H-Diotec-datasheet-159101088.pdf?src-supplier=SOS+electronic; ComponentLink3URL: https://datasheet.octopart.com/LDI1117-3.3H-Diotec-datasheet-189099648.pdf?src-supplier=Master+Electronics; ComponentLink3Description: https://datasheet.octopart.com/LDI1117-3.3H-Diotec-datasheet-189099648.pdf?src-supplier=Master+Electronics